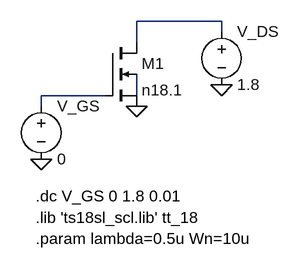
[diagram p0: schematic 2_b.asc]
2_b.asc, the LTspice schematic file:
Version 4
SHEET 1 880 680
WIRE 176 32 48 32
WIRE 176 48 176 32
WIRE 48 64 48 32
WIRE 0 144 -96 144
WIRE 48 144 48 112
WIRE -96 160 -96 144
FLAG -96 240 0
FLAG 48 160 0
FLAG 176 128 0
SYMBOL voltage -96 144 R0
WINDOW 123 0 0 Left 0
WINDOW 39 0 0 Left 0
SYMATTR InstName V_GS
SYMATTR Value 0
SYMBOL voltage 176 32 R0
WINDOW 123 0 0 Left 0
WINDOW 39 0 0 Left 0
SYMATTR InstName V_DS
SYMATTR Value 1.8
SYMBOL nmos4 0 64 R0
SYMATTR InstName M1
SYMATTR Value n18.1
SYMATTR Value2 l={2*lambda} w={Wn} ad={5*lambda*Wn} as={5*lambda*Wn} pd={2*Wn + 10*lambda} ps={2*Wn + 10*lambda}
TEXT -104 296 Left 2 !.dc V_GS 0 1.8 0.01
TEXT -104 360 Left 2 !.param lambda=0.5u Wn=10u
TEXT -104 328 Left 2 !.lib 'ts18sl_scl.lib' tt_18

The netlist it stands for:
* 2_b.asc
V_GS N002 0 0
V_DS N001 0 1.8
M1 N001 N002 0 N003 n18.1 l={2*lambda} w={Wn} ad={5*lambda*Wn} as={5*lambda*Wn} pd={2*Wn + 10*lambda} ps={2*Wn + 10*lambda}
.model NMOS NMOS
.model PMOS PMOS
.lib standard.mos
.dc V_GS 0 1.8 0.01
.param lambda=0.5u Wn=10u
.lib 'ts18sl_scl.lib' tt_18
.backanno
.end